# Altium project VC_Common.PrjPcb
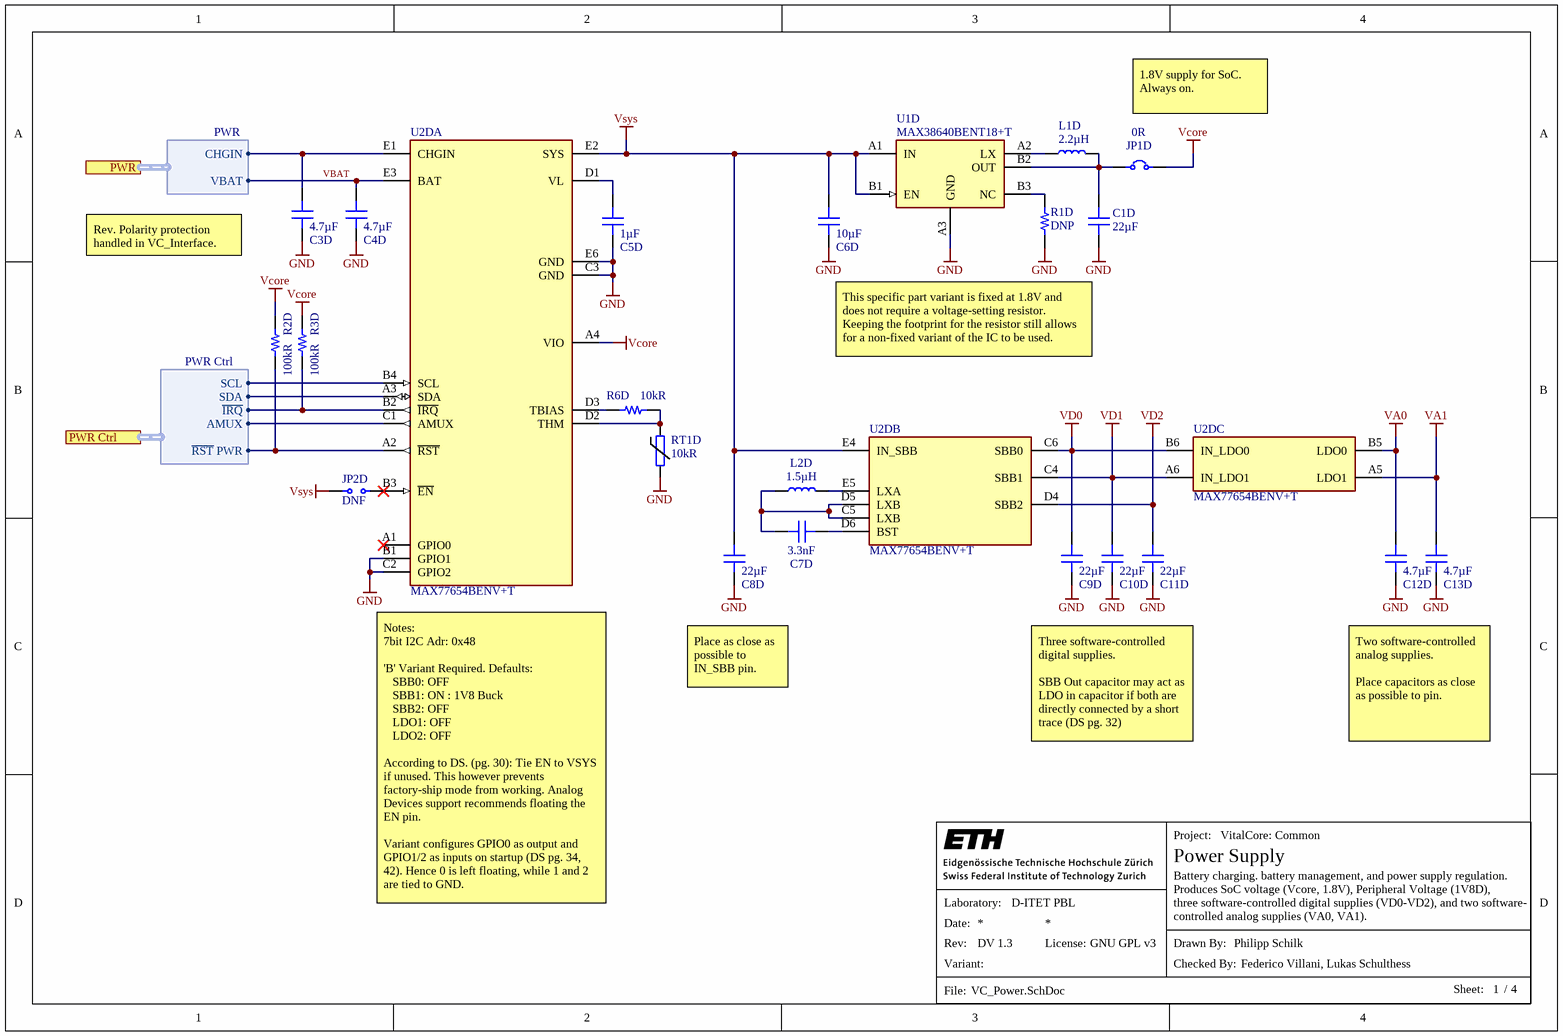
[diagram p0: VC_Power.SchDoc]
License: GNU GPL v3; Revision: DV 1.3; ProjectTitle: VitalCore: Common; Organization: D-ITET PBL; DrawnBy: Philipp Schilk; CheckedBy: Federico Villani, Lukas Schulthess
4 sheets, 54 parts. Net scope: flat (ports and power ports of the same name join across sheets).
Sheets:
  VC_Power.SchDoc
  VC_Interface.SchDoc
  VC_Peripherals.SchDoc
  VC_PanelCons.SchDoc

## Sheet VC_Power.SchDoc: Power Supply
size A4; SheetNumber: 1; SheetTotal: 4; Desc1: Battery charging. battery management, and power supply regulation.; Desc2: Produces SoC voltage (Vcore, 1.8V), Peripheral Voltage (1V8D),; Desc3: three software-controlled digital supplies (VD0-VD2), and two software-; Desc4: controlled analog supplies (VA0, VA1).; FileInfo: VC_Power.SchDoc

### Parts
C1D  22µF  [CAP_0402]
C3D  4.7µF  [CAP_0402]
C4D  4.7µF  [CAP_0402]
C5D  1µF  [CAP_0201]
C6D  10µF  [CAP_0402]
C7D  3.3nF  [CAP_0201]
C8D  22µF  [CAP_0603]
C9D  22µF  [CAP_0603]
C10D  22µF  [CAP_0603]
C11D  22µF  [CAP_0603]
C12D  4.7µF  [CAP_0402]
C13D  4.7µF  [CAP_0402]
JP1D  0R  [JMP_0201]
JP2D  DNF  [JMP_0201]  (no BOM)
L1D  2.2µH  [IND_0603]
L2D  1.5µH  [IND_0805_DFE201210S]
R1D  DNP  [RES_0201_DNF]  (no BOM)
R2D  100kR  [RES_0201]
R3D  100kR  [RES_0201]
R6D  10kR  [RES_0201]
RT1D  10kR  [RES_0201]
U1D  MAX38640BENT18+T  [THIN_WLP_6_MAX38640]
U2D  MAX77654BENV+T  [WLP_30_MAX77654]  (parts A,B,C of 3)

### Ports
PWR (harness PWR), PWR Ctrl (harness PWR Ctrl)

### Harnesses
PWR Ctrl: SDA, SCL, AMUX, ~{IRQ}, ~{RST} PWR
PWR: CHGIN, VBAT

### Nets
GND: C1D.1 C3D.1 C4D.1 C5D.1 C6D.1 C8D.1 C9D.1 C10D.1 C11D.1 C12D.1 C13D.1 R1D.1 RT1D.1 U1D.A3(GND) U2D.B1(GPIO1) U2D.C2(GPIO2) U2D.C3(GND) U2D.E6(GND)
VA0: C12D.2 U2D.B5(LDO0)
VA1: C13D.2 U2D.A5(LDO1)
Vcore: JP1D.2 R2D.2 R3D.2 U2D.A4(VIO)
VD0: C9D.2 U2D.B6(IN_LDO0) U2D.C6(SBB0)
VD1: C10D.2 U2D.A6(IN_LDO1) U2D.C4(SBB1)
VD2: C11D.2 U2D.D4(SBB2)
Vsys: C6D.2 C8D.2 JP2D.1 U1D.A1(IN) U1D.B1(EN) U2D.E2(SYS) U2D.E4(IN_SBB)
VBAT: C4D.2 U2D.E3(BAT) ; port PWR.VBAT
NetC1D_2: C1D.2 JP1D.1 L1D.2 U1D.B2(OUT)
NetC3D_2: C3D.2 U2D.E1(CHGIN) ; port PWR.CHGIN
NetC5D_2: C5D.2 U2D.D1(VL)
NetC7D_1: C7D.1 L2D.1 U2D.C5(LXB) U2D.D5(LXB)
NetC7D_2: C7D.2 U2D.D6(BST)
NetJP2D_2: JP2D.2 U2D.B3(~{EN})
NetL1D_1: L1D.1 U1D.A2(LX)
NetL2D_2: L2D.2 U2D.E5(LXA)
NetR1D_2: R1D.2 U1D.B3(NC)
NetR2D_1: R2D.1 U2D.A2(~{RST}) ; port PWR Ctrl.~{RST} PWR
NetR3D_1: R3D.1 U2D.B2(~{IRQ}) ; port PWR Ctrl.~{IRQ}
NetR6D_1: R6D.1 RT1D.2 U2D.D2(THM)
NetR6D_2: R6D.2 U2D.D3(TBIAS)
NetU2D_A3: U2D.A3(SDA) ; port PWR Ctrl.SDA
NetU2D_B4: U2D.B4(SCL) ; port PWR Ctrl.SCL
NetU2D_C1: U2D.C1(AMUX) ; port PWR Ctrl.AMUX

Not connected (* = marked no-connect by the designer): U2D A1(GPIO0)*

### Notes on the sheet
- 1.8V supply for SoC. Always on.
- Rev. Polarity protection handled in VC_Interface.
- This specific part variant is fixed at 1.8V and does not require a voltage-setting resistor. Keeping the footprint for the resistor still allows for a non-fixed variant of the IC to be used.
- Place as close as possible to IN_SBB pin.
- Three software-controlled digital supplies.
  SBB Out capacitor may act as LDO in capacitor if both are directly connected by a short trace (DS pg. 32)
- Two software-controlled analog supplies.
  Place capacitors as close as possible to pin.
- (near U2D) Notes:
  7bit I2C Adr: 0x48
  'B' Variant Required. Defaults:
  SBB0: OFF
  SBB1: ON : 1V8 Buck
  SBB2: OFF
  LDO1: OFF
  LDO2: OFF
  According to DS. (pg. 30): Tie EN to VSYS if unused. This however prevents factory-ship mode from working. Analog Devices support recommends floating the EN pin.
  Variant configures GPIO0 as output and GPIO1/2 as inputs on startup (DS pg. 34, 42). Hence 0 is left floating, while 1 and 2 are tied to GND.
- Project:
- Laboratory:
- Date:
- File:
- Rev:
- Variant:
- License:
- Drawn By:
- Checked By:
- Sheet:
- /

### Library data of the parts
C1D = CAP_0402_22u_6V3: CAP CER 22UF 6.3V X5R 0402; Manufacturer: Kyocera AVX; Manufacturer Part Number: CM05X5R226M06AH080; Supplier 1: Mouser; Supplier Part Number 1: 346-CM05X5R226M6AH80
C3D C4D C12D C13D = CAP_0402_4.7u_16V: CAP CER 4.7UF 16V X5R 0402; Manufacturer: Kyocera AVX; Manufacturer Part Number: 0402YD475MAT2A; Supplier 1: Mouser; Supplier Part Number 1: 581-0402YD475MAT2A
C5D = CAP_0201_1u_10V: CAP CER 1UF 10V X6S; Manufacturer: Murata; Manufacturer Part Number: GRM033C81A105ME05D; Supplier 1: Mouser; Supplier Part Number 1: 81-GRM033C81A105ME5D
C6D = CAP_0402_10u_10V: CAP CER 10UF 10V X5R 0402; Manufacturer: Samsung; Manufacturer Part Number: CL05A106MP5NUNC; Supplier 1: Mouser; Supplier Part Number 1: 187-CL05A106MP5NUNC
C7D = CAP_0201_3.3n_16V: CAP CER 3.3NF 16V X7R 0201; Manufacturer: Murata; Manufacturer Part Number: GRM033R71C332KA88D; Supplier 1: Mouser; Supplier Part Number 1: 81-GRM033R71C332KA88
C8D C9D C10D C11D = CAP_0603_22u_10V: CAP CER 22UF 10V X7R 0603; Manufacturer: Murata; Manufacturer Part Number: GRM187R61A226ME15D; Supplier 1: Mouser; Supplier Part Number 1: 81-GRM187R61A226ME5D
JP1D = JMP_0201: ERJ Series 0201 0 Ohm 0.05 W Jumper Surface Mount Thick Film Chip Resistor; Manufacturer: Panasonic; Manufacturer Part Number: ERJ-1GN0R00C; Supplier 1: Mouser; Supplier Part Number 1: 667-ERJ-1GN0R00C
JP2D = JMP_0201_DNF: JMP 0201 NO TRACE DNF
L1D = L_0603_2.2uH_520mA: L 2.2uH 520mA 0603; Manufacturer: Taiyo Yuden; Manufacturer Part Number: MBKK1608T2R2M; Supplier 1: Mouser; Supplier Part Number 1: 963-MBKK1608T2R2M
L2D = L_0805_1.5uH_2A: L 1.5uH 2A 0805; Manufacturer: Murata; Manufacturer Part Number: DFE201210S-1R5M=P2; Supplier 1: Mouser; Supplier Part Number 1: 81-DFE201210S-1R5MP2
R1D = R_0201_DNP: R DNP 0201
R2D R3D = R_0201_100K: R 100K 1% 50mW 0201; Manufacturer: Panasonic; Manufacturer Part Number: ERJ-1GNF1003C; Supplier 1: Mouser; Supplier Part Number 1: 667-ERJ-1GNF1003C
R6D = R_0201_10K: R 10K 1% 50mW 0201; Manufacturer: Panasonic; Manufacturer Part Number: ERJ-1GNF1002C; Supplier 1: Mouser; Supplier Part Number 1: 667-ERJ-1GNF1002C
RT1D = NTC_0201_10k: NTC 10K 1% 0201 3380K; Manufacturer: Panasonic; Manufacturer Part Number: ERTJZEG103FA; Supplier 1: Mouser; Supplier Part Number 1: 667-ERT-JZEG103FA
U1D = MAX38640BENT18+T: Buck Switching Regulator IC Positive Fixed 1.8V 1 Output 175mA 6-WLP; Manufacturer: Maxim; Supplier 1: Mouser; Supplier Part Number 1: 700-MAX38640BENT18T; Manufacturer Part Number: MAX38640BENT18+T
U2D = MAX77654BENV+T: Buck-Boost Converter With LDO Regulator 5-OUT 30-Pin WLP T/R; Manufacturer: Maxim; Supplier 1: Mouser; Manufacturer Part Number: MAX77654BENV+T; Supplier Part Number 1: 700-MAX77654BENV+T

## Sheet VC_Interface.SchDoc: Interface
size A4; SheetNumber: 2; SheetTotal: 4; FileInfo: VC_Interface.SchDoc
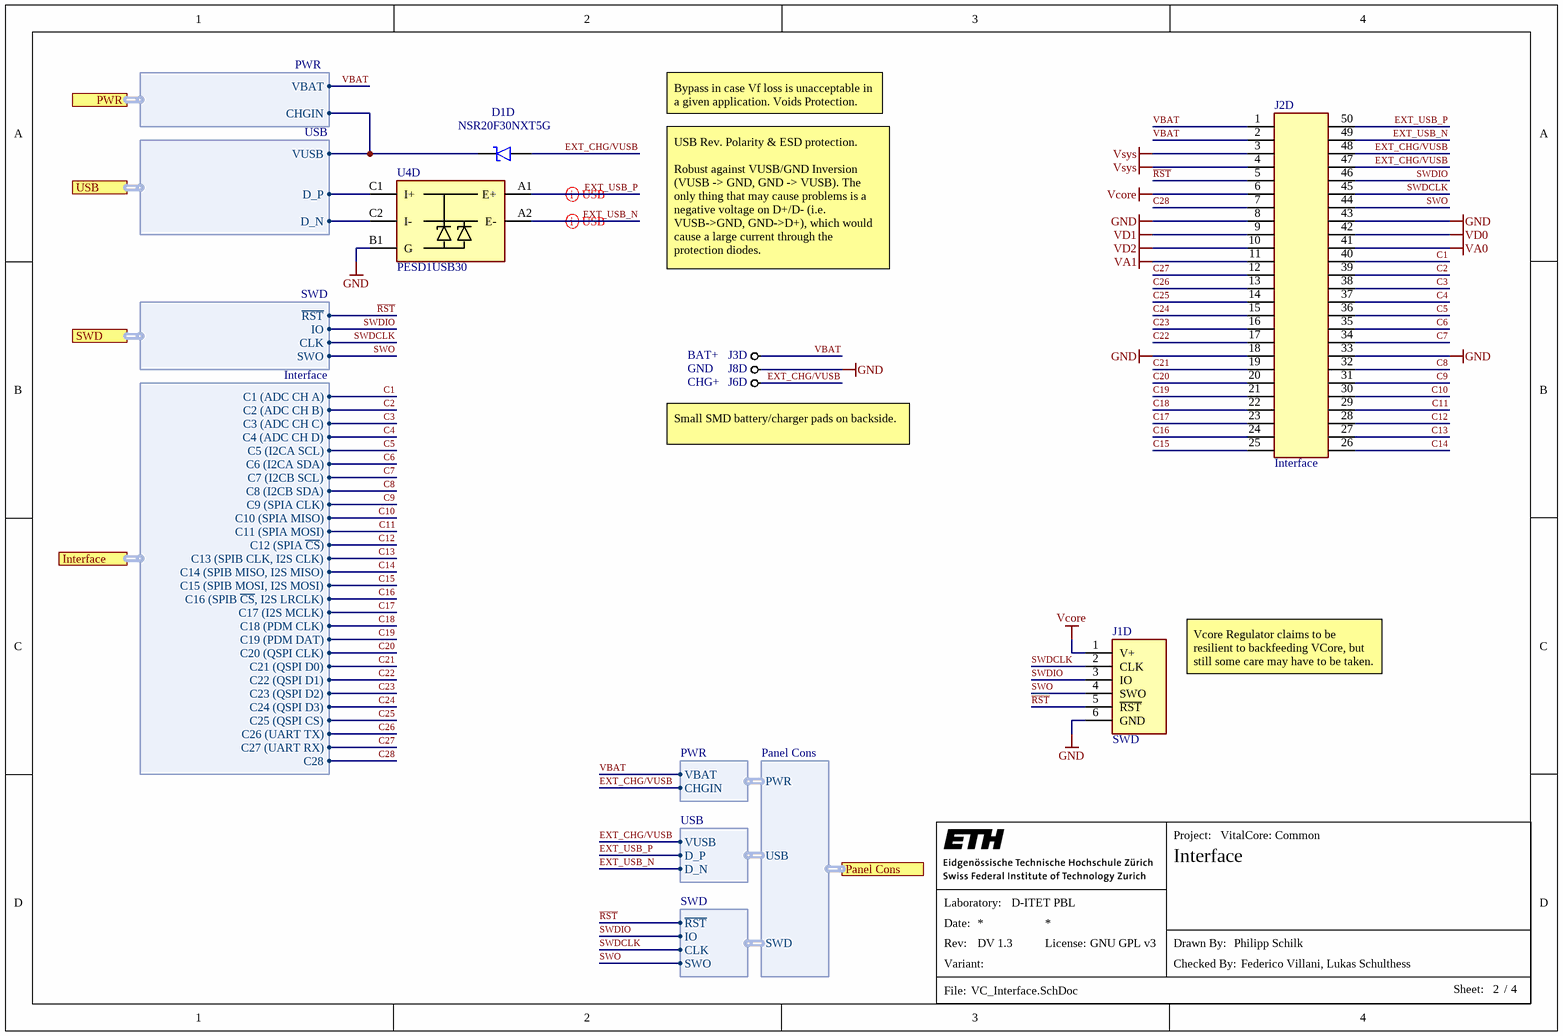
[diagram p1: VC_Interface.SchDoc]

### Parts
D1D  NSR20F30NXT5G  [DSN2_ONSemi]
J1D  SWD  [CONN_SWD_PADS_P1.27mm]  (no BOM)
J2D  Interface  [CONN_COMBI_50P]
J3D  BAT+  [PADSMD_ROUND]  (no BOM)
J6D  CHG+  [PADSMD_ROUND]  (no BOM)
J8D  GND  [PADSMD_ROUND]  (no BOM)
U4D  PESD1USB30  [WLCSP_5_2-1-2_P0.4]

### Ports
Interface (harness Interface), Panel Cons (harness Panel Cons), PWR (harness PWR), SWD (harness SWD), USB (harness USB)

### Harnesses
PWR: CHGIN, VBAT
SWD: ~{RST}, IO, CLK, SWO
Interface: C1 (ADC CH A), C2 (ADC CH B), C3 (ADC CH C), C4 (ADC CH D), C5 (I2CA SCL), C6 (I2CA SDA), C7 (I2CB SCL), C8 (I2CB SDA), C9 (SPIA CLK), C10 (SPIA MISO), C11 (SPIA MOSI), C12 (SPIA ~{CS}), C13 (SPIB CLK, I2S CLK), C14 (SPIB MISO, I2S MISO), C15 (SPIB MOSI, I2S MOSI), C16 (SPIB ~{CS}, I2S LRCLK), C17 (I2S MCLK), C18 (PDM CLK), C19 (PDM DAT), C20 (QSPI CLK), C21 (QSPI D0), C22 (QSPI D1), C23 (QSPI D2), C24 (QSPI D3), C25 (QSPI CS), C26 (UART TX), C27 (UART RX), C28
USB: VUSB, D_P, D_N
Panel Cons: PWR, USB, SWD

### Nets
GND: J1D.6(GND) J2D.8 J2D.18 J2D.33 J2D.43 J8D.0 U4D.B1(G)
VA0: J2D.41
VA1: J2D.11
Vcore: J1D.1(V+) J2D.6
VD0: J2D.42
VD1: J2D.9
VD2: J2D.10
Vsys: J2D.3 J2D.4
C1: J2D.40 ; port Interface.C1 (ADC CH A)
C2: J2D.39 ; port Interface.C2 (ADC CH B)
C3: J2D.38 ; port Interface.C3 (ADC CH C)
C4: J2D.37 ; port Interface.C4 (ADC CH D)
C5: J2D.36 ; port Interface.C5 (I2CA SCL)
C6: J2D.35 ; port Interface.C6 (I2CA SDA)
C7: J2D.34 ; port Interface.C7 (I2CB SCL)
C8: J2D.32 ; port Interface.C8 (I2CB SDA)
C9: J2D.31 ; port Interface.C9 (SPIA CLK)
C10: J2D.30 ; port Interface.C10 (SPIA MISO)
C11: J2D.29 ; port Interface.C11 (SPIA MOSI)
C12: J2D.28 ; port Interface.C12 (SPIA ~{CS})
C13: J2D.27 ; port Interface.C13 (SPIB CLK, I2S CLK)
C14: J2D.26 ; port Interface.C14 (SPIB MISO, I2S MISO)
C15: J2D.25 ; port Interface.C15 (SPIB MOSI, I2S MOSI)
C16: J2D.24 ; port Interface.C16 (SPIB ~{CS}, I2S LRCLK)
C17: J2D.23 ; port Interface.C17 (I2S MCLK)
C18: J2D.22 ; port Interface.C18 (PDM CLK)
C19: J2D.21 ; port Interface.C19 (PDM DAT)
C20: J2D.20 ; port Interface.C20 (QSPI CLK)
C21: J2D.19 ; port Interface.C21 (QSPI D0)
C22: J2D.17 ; port Interface.C22 (QSPI D1)
C23: J2D.16 ; port Interface.C23 (QSPI D2)
C24: J2D.15 ; port Interface.C24 (QSPI D3)
C25: J2D.14 ; port Interface.C25 (QSPI CS)
C26: J2D.13 ; port Interface.C26 (UART TX)
C27: J2D.12 ; port Interface.C27 (UART RX)
C28: J2D.7 ; port Interface.C28
EXT_CHG/VUSB: D1D.2(Anode) J2D.47 J2D.48 J6D.0 ; harness USB.VUSB, harness PWR.CHGIN
EXT_USB_N: J2D.49 U4D.A2(E-) ; harness USB.D_N
EXT_USB_P: J2D.50 U4D.A1(E+) ; harness USB.D_P
~{RST}: J1D.5(~{RST}) J2D.5 ; port SWD.~{RST}, harness SWD.~{RST}
SWDCLK: J1D.2(CLK) J2D.45 ; port SWD.CLK, harness SWD.CLK
SWDIO: J1D.3(IO) J2D.46 ; port SWD.IO, harness SWD.IO
SWO: J1D.4(SWO) J2D.44 ; port SWD.SWO, harness SWD.SWO
VBAT: J2D.1 J2D.2 J3D.0 ; port PWR.VBAT, harness PWR.VBAT
NetC3D_2: D1D.1(Cathode) ; port PWR.CHGIN, port USB.VUSB
NetU4D_C1: U4D.C1(I+) ; port USB.D_P
NetU4D_C2: U4D.C2(I-) ; port USB.D_N

### Layout directives
differential pair: EXT_USB_N, EXT_USB_P

### Notes on the sheet
- Bypass in case Vf loss is unacceptable in a given application. Voids Protection.
- USB Rev. Polarity & ESD protection.
  Robust against VUSB/GND Inversion (VUSB -> GND, GND -> VUSB). The only thing that may cause problems is a negative voltage on D+/D- (i.e. VUSB->GND, GND->D+), which would cause a large current through the protection diodes.
- Small SMD battery/charger pads on backside.
- Vcore Regulator claims to be resilient to backfeeding VCore, but still some care may have to be taken.
- Project:
- Laboratory:
- Date:
- File:
- Rev:
- Variant:
- License:
- Drawn By:
- Checked By:
- Sheet:
- /

### Library data of the parts
D1D = D_NSR20F30NXT5G: Small Signal Schottky Diode, 30 V, 2 A; Manufacturer: ON Semiconductor; Supplier 1: Mouser; Manufacturer Part Number: NSR20F30NXT5G; Supplier Part Number 1: 863-NSR20F30NXT5G
J1D = CONN_SWD_PADS: SWD Pogo Pads
J2D = CONN_50P_M_COMBI_INTERFACE: 50Pin 0.4mm pitch connector footprint that accepts (male) connectors intended for different stacking heights: / Hirose - DF40C-50DP-0.4V(51) for 1.5mm - 3mm stacking height / JAE - WP7B-P050VA1-R8000 - for 0.7mm stacking height
J3D J6D J8D = PADSMD: SMD Pad
U4D = PESD1USB30: ESD Suppressor Diode TVS Uni-Dir 5V 5-Pin WLCSP T/R; Manufacturer: NXP Semiconductors; Manufacturer Part Number: PESD1USB30; Supplier 1: Mouser; Supplier Part Number 1: 771-PESD1USB30Z

## Sheet VC_Peripherals.SchDoc: On-Board Peripherals
size A4; SheetNumber: 3; SheetTotal: 4; FileInfo: VC_Peripherals.SchDoc
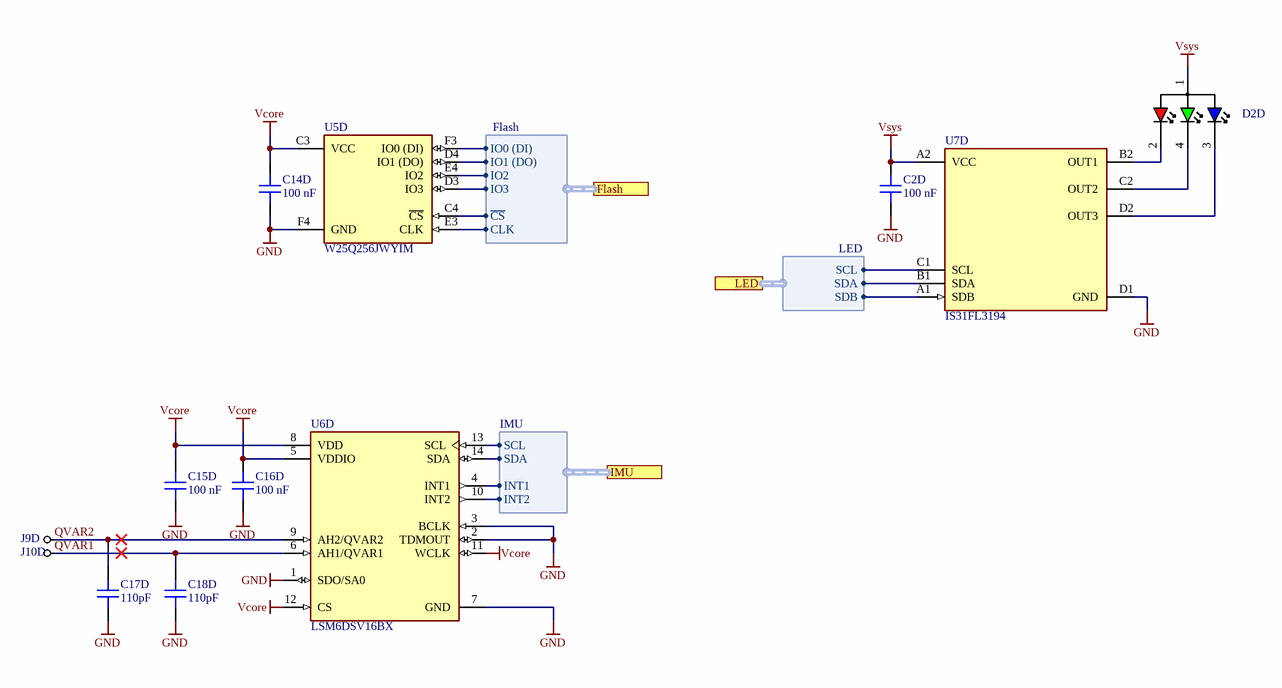
[diagram p2: VC_Peripherals.SchDoc]

### Parts
C2D  100 nF  [CAP_0201]
C14D  100 nF  [CAP_0201]
C15D  100 nF  [CAP_0201]
C16D  100 nF  [CAP_0201]
C17D  110pF  [CAP_0201]
C18D  110pF  [CAP_0201]
D2D  SML-LX0404SIUPGUSB  [SML-LX0404SIUPGUSB]  (value not drawn)
J9D  PADSMD  [PADSMD_ROUND]  (value not drawn)  (no BOM)
J10D  PADSMD  [PADSMD_ROUND]  (value not drawn)  (no BOM)
U5D  W25Q256JWYIM  [WLCSP_32_W25Q256JWYIM]
U6D  LSM6DSV16BX  [LGA-14_STM]
U7D  IS31FL3194  [WLCSP_8_P0.4]

### Ports
Flash (harness Flash), IMU (harness IMU), LED (harness LED)

### Harnesses
Flash: IO0 (DI), IO1 (DO), IO2, IO3, ~{CS}, CLK
IMU: SCL, SDA, INT1, INT2
LED: SCL, SDA, SDB

### Nets
GND: C2D.1 C14D.1 C15D.1 C16D.1 C17D.1 C18D.1 U5D.F4(GND) U6D.1(SDO/SA0) U6D.2(TDMOUT) U6D.3(BCLK) U6D.7(GND) U7D.D1(GND)
Vcore: C14D.2 C15D.2 C16D.2 U5D.C3(VCC) U6D.5(VDDIO) U6D.8(VDD) U6D.11(WCLK) U6D.12(CS)
Vsys: C2D.2 D2D.1(Common_Anode) U7D.A2(VCC)
QVAR1: C18D.2 J10D.0 U6D.6(AH1/QVAR1)
QVAR2: C17D.2 J9D.0 U6D.9(AH2/QVAR2)
NetD2D_2: D2D.2(Red_C) U7D.B2(OUT1)
NetD2D_3: D2D.3(Blue_C) U7D.D2(OUT3)
NetD2D_4: D2D.4(Green_C) U7D.C2(OUT2)
NetU5D_C4: U5D.C4(~{CS}) ; port Flash.~{CS}
NetU5D_D3: U5D.D3(IO3) ; port Flash.IO3
NetU5D_D4: U5D.D4(IO1_(DO)) ; port Flash.IO1 (DO)
NetU5D_E3: U5D.E3(CLK) ; port Flash.CLK
NetU5D_E4: U5D.E4(IO2) ; port Flash.IO2
NetU5D_F3: U5D.F3(IO0_(DI)) ; port Flash.IO0 (DI)
NetU6D_4: U6D.4(INT1) ; port IMU.INT1
NetU6D_10: U6D.10(INT2) ; port IMU.INT2
NetU6D_13: U6D.13(SCL) ; port IMU.SCL
NetU6D_14: U6D.14(SDA) ; port IMU.SDA
NetU7D_A1: U7D.A1(SDB) ; port LED.SDB
NetU7D_B1: U7D.B1(SDA) ; port LED.SDA
NetU7D_C1: U7D.C1(SCL) ; port LED.SCL

### Notes on the sheet
- Project:
- Laboratory:
- Date:
- File:
- Rev:
- Variant:
- License:
- Drawn By:
- Checked By:
- Sheet:
- /

### Library data of the parts
C2D C14D C15D C16D = CAP_0201_100n_10V: CAP CER 0.1UF 10V X5R 0201; Manufacturer: Murata; Manufacturer Part Number: GRM033Z71A104KE14D; Supplier 1: Mouser; Supplier Part Number 1: 81-GRM033Z71A104KE4D
C17D C18D = CAP_0201_110p_50V: CAP CER 110PF 50V C0G 0201; Manufacturer: Murata; Manufacturer Part Number: GRM0335C1H111JA01D; Supplier 1: Mouser; Supplier Part Number 1: 81-GRM0335C1H111JA1D
D2D = D_RGB_LED: SML-LX0404SIUPGUSB RGB LED; Manufacturer: Lumex; Supplier 1: Mouser; Manufacturer Part Number: SML-LX0404SIUPGUSB; Supplier Part Number 1: 696-LX0404SIUPGUSB
J9D J10D = PADSMD: SMD Pad
U5D = W25Q256JWYIM: NOR-Flash spiFlash, 1.8V, 256M-bit, 4Kb Uniform Sector, DTR; Manufacturer Part Number: W25Q256JWYIM TR; Manufacturer: Winbond; Supplier 1: Mouser; Supplier Part Number 1: 454-W25Q256JWYIMTR
U6D = LSM6DSV16BX: IMU ACCEL/GYRO I2C/SPI 14LGA; Manufacturer: STMicroelectronics; Manufacturer Part Number: LSM6DSV16BX; Supplier 1: Mouser; Supplier Part Number 1: 511-LSM6DSV16BXTR
U7D = IS31FL3194: LED Driver with Programmable Pattern Sequencing 3-Channel 40mA 8-Pin WCSP T/R; Manufacturer: ISSI; Manufacturer Part Number: IS31FL3194-CLS2-TR; Supplier 1: Digi-Key; Supplier Part Number 1: 2521-IS31FL3194-CLS2-TRCT-ND

## Sheet VC_PanelCons.SchDoc: Debug Panel Connections
size A4; SheetNumber: 4; SheetTotal: 4; FileInfo: VC_PanelCons.SchDoc
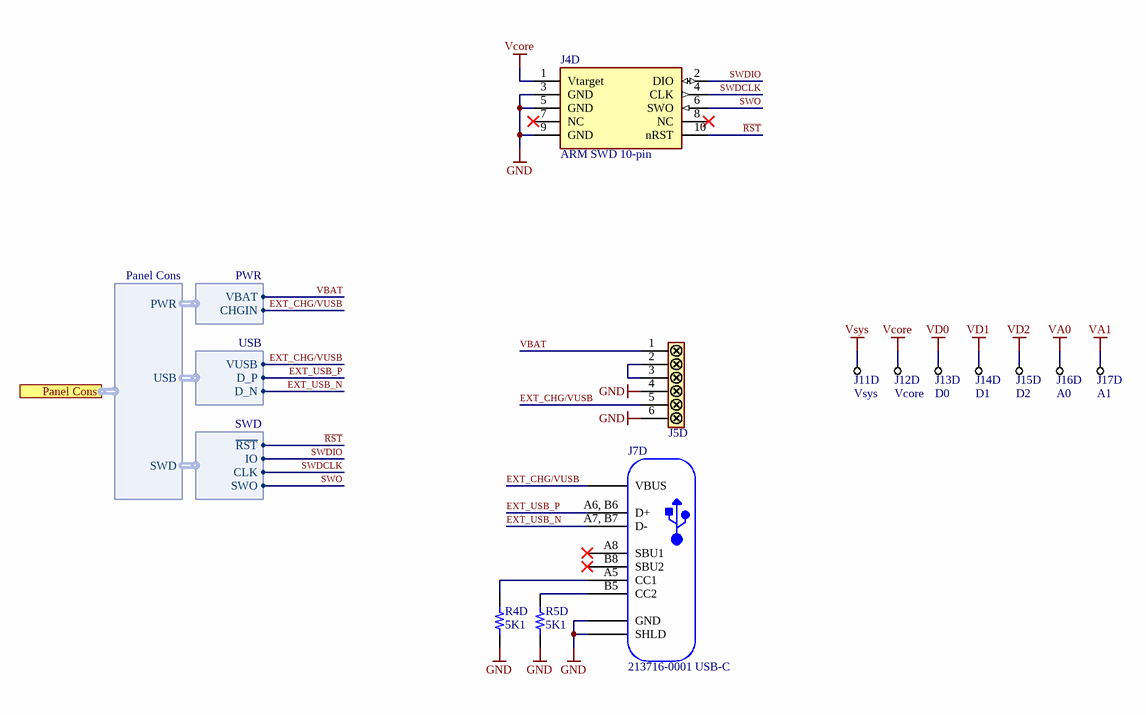
[diagram p3: VC_PanelCons.SchDoc]

### Parts
J4D  ARM SWD 10-pin  [CONN_SWD]
J5D  6Pin  [CONN_PINHEADER_6PIN]  (value not drawn)
J7D  213716-0001 USB-C  [CONN_USBC_2137160001]
J11D  Vsys  [PADSMD_ROUND]  (no BOM)
J12D  Vcore  [PADSMD_ROUND]  (no BOM)
J13D  D0  [PADSMD_ROUND]  (no BOM)
J14D  D1  [PADSMD_ROUND]  (no BOM)
J15D  D2  [PADSMD_ROUND]  (no BOM)
J16D  A0  [PADSMD_ROUND]  (no BOM)
J17D  A1  [PADSMD_ROUND]  (no BOM)
R4D  5K1  [RES_0402]
R5D  5K1  [RES_0402]

### Ports
Panel Cons (harness Panel Cons)

### Harnesses
PWR: CHGIN, VBAT
SWD: ~{RST}, IO, CLK, SWO
Panel Cons: PWR, USB, SWD
USB: VUSB, D_P, D_N

### Nets
GND: J4D.3(GND) J4D.5(GND) J4D.9(GND) J5D.4 J5D.6 J7D.0(SHLD) J7D.A1(GND) R4D.1 R5D.1
VA0: J16D.0
VA1: J17D.0
Vcore: J4D.1(Vtarget) J12D.0
VD0: J13D.0
VD1: J14D.0
VD2: J15D.0
Vsys: J11D.0
EXT_CHG/VUSB: J5D.5 J7D.A4(VBUS) ; harness PWR.CHGIN, harness USB.VUSB
EXT_USB_N: J7D.A7,_B7(D-) ; harness USB.D_N
EXT_USB_P: J7D.A6,_B6(D+) ; harness USB.D_P
~{RST}: J4D.10(nRST) ; harness SWD.~{RST}
SWDCLK: J4D.4(CLK) ; harness SWD.CLK
SWDIO: J4D.2(DIO) ; harness SWD.IO
SWO: J4D.6(SWO) ; harness SWD.SWO
VBAT: J5D.1 ; harness PWR.VBAT
NetJ5D_2: J5D.2 J5D.3
NetJ7D_A5: J7D.A5(CC1) R4D.2
NetJ7D_B5: J7D.B5(CC2) R5D.2

Not connected (* = marked no-connect by the designer): J4D 7(NC)* 8(NC)*; J7D A8(SBU1)* B8(SBU2)*

### Notes on the sheet
- Project:
- Laboratory:
- Date:
- File:
- Rev:
- Variant:
- License:
- Drawn By:
- Checked By:
- Sheet:
- /

### Library data of the parts
J4D = CONN_SWD: ARM 10-pin SWD Connector.; Supplier 1: Mouser; Supplier Part Number 1: 710-62201021121
J5D = CONN_PINHEADER_6PIN: 6 Pin Pinheader.
J7D = CONN_USB_C: Connector USB Type C Receptacle 16 Position 0.5mm Surface Mount Right Angle Emboss T/R; pin to pad: A1>A1+B12+A12+B1 A4>A4+B9+A9+B4 A6, B6>A6+B6 A7, B7>A7+B7; Manufacturer: Molex; Manufacturer Part Number: 213716-0001; Supplier 1: Mouser; Supplier Part Number 1: 538-213716-0001
J11D J12D J13D J14D J15D J16D J17D = PADSMD: SMD Pad
R4D R5D = R_0402_5K1: R 5120R 1% 100mW 0402; Manufacturer: Panasonic; Manufacturer Part Number: ERJ-2RKF5101X; Supplier 1: Mouser; Supplier Part Number 1: 667-ERJ-2RKF5101X

## Nets that join several sheets
GND: VC_Power (18 pins), VC_Interface (7 pins), VC_Peripherals (12 pins), VC_PanelCons (9 pins)
VA0: VC_Power (C12D.2 U2D.B5), VC_Interface (J2D.41), VC_PanelCons (J16D.0)
VA1: VC_Power (C13D.2 U2D.A5), VC_Interface (J2D.11), VC_PanelCons (J17D.0)
Vcore: VC_Power (JP1D.2 R2D.2 R3D.2 U2D.A4), VC_Interface (J1D.1 J2D.6), VC_Peripherals (8 pins), VC_PanelCons (J4D.1 J12D.0)
VD0: VC_Power (C9D.2 U2D.B6 U2D.C6), VC_Interface (J2D.42), VC_PanelCons (J13D.0)
VD1: VC_Power (C10D.2 U2D.A6 U2D.C4), VC_Interface (J2D.9), VC_PanelCons (J14D.0)
VD2: VC_Power (C11D.2 U2D.D4), VC_Interface (J2D.10), VC_PanelCons (J15D.0)
Vsys: VC_Power (7 pins), VC_Interface (J2D.3 J2D.4), VC_Peripherals (C2D.2 D2D.1 U7D.A2), VC_PanelCons (J11D.0)
EXT_CHG/VUSB: VC_Interface (D1D.2 J2D.47 J2D.48 J6D.0), VC_PanelCons (J5D.5 J7D.A4)
EXT_USB_N: VC_Interface (J2D.49 U4D.A2), VC_PanelCons (J7D.A7, B7)
EXT_USB_P: VC_Interface (J2D.50 U4D.A1), VC_PanelCons (J7D.A6, B6)
NetC3D_2: VC_Power (C3D.2 U2D.E1), VC_Interface (D1D.1)
~{RST}: VC_Interface (J1D.5 J2D.5), VC_PanelCons (J4D.10)
SWDCLK: VC_Interface (J1D.2 J2D.45), VC_PanelCons (J4D.4)
SWDIO: VC_Interface (J1D.3 J2D.46), VC_PanelCons (J4D.2)
SWO: VC_Interface (J1D.4 J2D.44), VC_PanelCons (J4D.6)
VBAT: VC_Power (C4D.2 U2D.E3), VC_Interface (J2D.1 J2D.2 J3D.0), VC_PanelCons (J5D.1)